# EAGLE design XR2 (EAGLE 7.4.0)
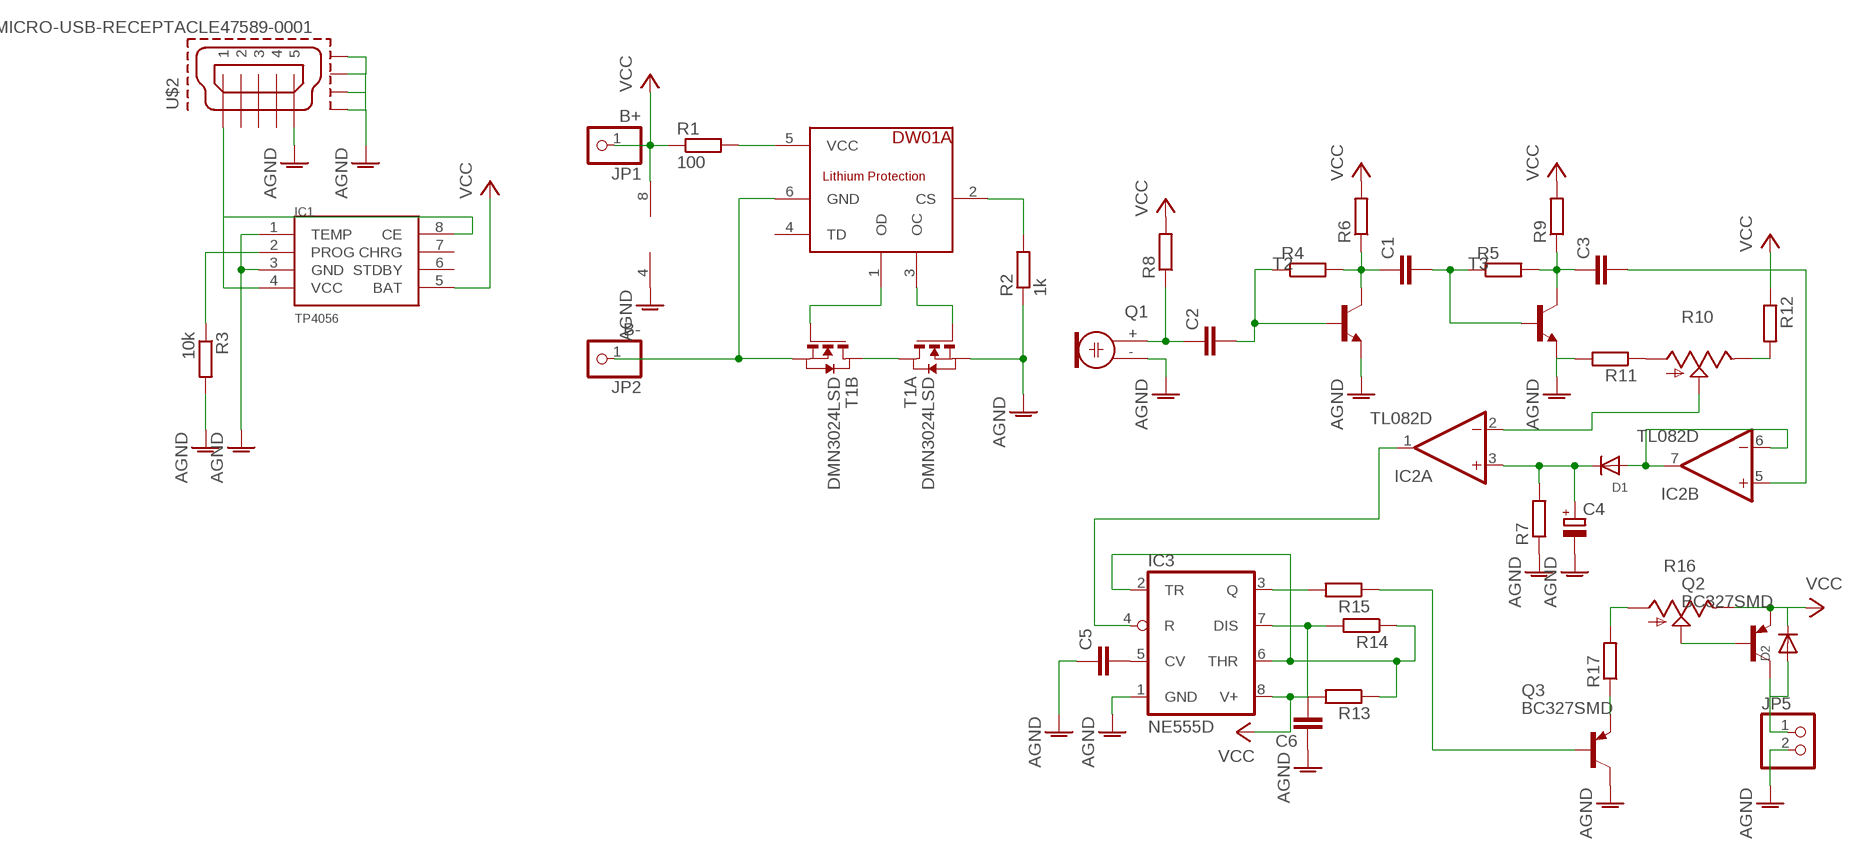
[diagram p0: schematic, sheet 1]

## Parts
C1  C-EUC0603  [C0603]
C2  C-EUC0603  [C0603]
C3  C-EUC0603  [C0603]
C4  CPOL-EU153CLV-0605  [153CLV-0605]
C5  C-EUC0603  [C0603]
C6  C-EUC0603  [C0603]
D1  DIODESOT23_REFLOW  [SOT23-R]
D2  DIODESOT23_REFLOW  [SOT23-R]
IC1  TP4056  [SOP-8]
IC2  TL082D  [SO08]
IC3  NE555D  [SO08]
JP1  B+  PINHD-1X1  [1X01]
JP2  B-  PINHD-1X1  [1X01]
JP5  PINHD-1X2  [1X02]
Q1  ELECTRET  [9.7ELECTRET]
Q2  BC327SMD  [SOT23-BEC]
Q3  BC327SMD  [SOT23-BEC]
R1  100  R-EU_R0805  [R0805]
R2  1k  R-EU_R0805  [R0805]
R3  10k  R-EU_R0805  [R0805]
R4  R-EU_R0603  [R0603]
R5  R-EU_R0603  [R0603]
R6  R-EU_R0603  [R0603]
R7  R-EU_R0603  [R0603]
R8  R-EU_R0603  [R0603]
R9  R-EU_R0603  [R0603]
R10  TRIM_US-B25U  [B25U]
R11  R-EU_R0603  [R0603]
R12  R-EU_R0603  [R0603]
R13  R-EU_R0603  [R0603]
R14  R-EU_R0603  [R0603]
R15  R-EU_R0603  [R0603]
R16  TRIM_US-B25U  [B25U]
R17  R-EU_R0603  [R0603]
T1  DMN3024LSD  [TSSOP-8]
T2  MMBT3904LT1-NPN-SOT23-BEC  [SOT23-BEC]
T3  MMBT3904LT1-NPN-SOT23-BEC  [SOT23-BEC]
U$1  DW01A  [SOT23-6]
U$2  MICRO-USB-RECEPTACLE47589-0001  [47589-0001]

## Nets
AGND: C4.- C5.1 C6.1 IC1.1(TEMP) IC1.3(GND) IC2.4(P:V-) IC3.1(GND) JP5.2 Q1.- Q3.C R2.1 R3.2 R7.1 R11.2 T1.2(A:S) T1.3(A:S) T2.E T3.E U$2.5 U$2.CASING1(GND1) U$2.CASING2(GND2) U$2.CASING3(GND3) U$2.CASING4(GND4)
N$1: T1.4(A:G) U$1.3(OC)
N$2: T1.5(B:G) U$1.1(OD)
N$3: T1.1(A:D) T1.8(B:D)
N$4: R2.2 U$1.2(CS)
N$5: JP2.1 T1.6(B:S) T1.7(B:S) U$1.6(GND)
N$6: R1.2 U$1.5(VCC)
N$7: IC1.2(PROG) R3.1
N$8: IC2.2(A:-IN) R10.S
N$9: IC1.4(VCC) IC1.8(CE) U$2.1
N$10: C2.1 Q1.+ R8.1
N$11: C2.2 R4.1 T2.B
N$12: C1.1 R4.2 R6.1 T2.C
N$13: C3.1 R5.2 R9.1 T3.C
N$14: C1.2 R5.1 T3.B
N$15: D1.1(A) IC2.6(B:-IN) IC2.7(B:OUT)
N$16: R10.A R11.1
N$17: C3.2 IC2.5(B:+IN)
N$18: C4.+ D1.3(C) IC2.3(A:+IN) R7.2
N$19: R10.E R12.2
N$20: IC2.1(A:OUT) IC3.4(R)
N$21: IC3.2(TR) IC3.6(THR) R13.1 R14.1
N$22: C5.2 IC3.5(CV)
N$23: IC3.3(Q) R15.2
N$24: Q3.B R15.1
N$25: C6.2 IC3.7(DIS) R14.2
N$26: Q3.E R17.1
N$27: R16.A R17.2
N$28: Q2.B R16.S
N$29: D2.1(A) JP5.1 Q2.C
VCC: D2.3(C) IC1.5(BAT) IC2.8(P:V+) IC3.8(V+) JP1.1 Q2.E R1.1 R6.2 R8.2 R9.2 R12.1 R13.2 R16.E
Unconnected: IC1.6(STDBY) IC1.7(CHRG) U$1.4(TD) U$2.2 U$2.3 U$2.4

## Library data of the parts
C1-C3 C5 C6 = rcl:C-EU: CAPACITOR, European symbol
C4 = rcl:CPOL-EU: POLARIZED CAPACITOR, European symbol
D1 D2 = adafruit:DIODE: Diode SMADIODE - SMA Surface Mount Package 20V 1A Schottky Diode Digikey: 641-1014-6-ND DO-1N4148 - Through Hole Small Current Diode SOD-123 20V 1 A (.5mV Vf) Schottky Diode - Digikey: MBRX120TPMSCT-ND SOD-323 10V 570mA (.38mV Vf, 3ns) Schottky Diode - Digikey: ZLLS410CT-ND SOD-523 30V 30mA Schottky Diode (RB751S-40TE61) - Digikey: RB751S-40TE61CT-ND SOT23-R/W - SOT23 Package (R = Solder Paste/Reflow Ovens, W = Hand-Soldering) BAT54Film 40V 300mA - Digikey: 497-7162-1-ND
IC1 = TP4056:TP4056
IC2 = linear:TL082: OP AMP Data sheet <http://www.ti.com/lit/ds/symlink/tl084a . pdf>; DATA_SHEET: <a href="http://www.ti.com/lit/ds/symlink/tl084a.pdf"> Data sheet </a>
IC3 = adafruit:*555: TIMER Changed DIP package to have round (not oval) pin pads http://www.ladyada.net/library/pcb/eaglelibrary.html
JP1 JP2 = pinhead:PINHD-1X1: PIN HEADER
JP5 = pinhead:PINHD-1X2: PIN HEADER
Q1 = adafruit:ELECTRET: Electret microphone Thru hole 2.54mm spacing with 9.7mm diameter
Q2 Q3 = transistor-pnp:BC327*: PNP Transistror
R1-R9 R11-R15 R17 = rcl:R-EU_: RESISTOR, European symbol
R10 R16 = pot:TRIM_US-: POTENTIOMETER
T1 = FS8205A:DMN3024LSD: DUAL N-CHANNEL ENHANCEMENT MODE MOSFET data sheet <http://goo.gl/dRgboR> Dave.Calaway Eagle Library <https://goo.gl/Muy1Tr>
T2 T3 = transistor-neu-to92:*-NPN-: NPN Transistror
U$1 = DW01a:DW01A
U$2 = con-molex-usb:MICRO-USB-RECEPTACLE: MICRO USB RECEPTACLES Micro-USB Receptacles, SMT, Lead-Free from MOLEX <http://www.molex.com/>. (C) 2014 Tomasz Boleslaw CEDRO, cederom@tlen.pl, http://www.tomek.cedro.info. Version 0.1 (2014-01-17): Initial release. Version 0.2 (2014-02-06): Updated 47589-0001 footprint pins/pads/milling. Following devices are included: 1. 47589-0001 Micro-USB AB Receptacle, Bottom Mount, SMT, Lead-Free <http://www.molex.com/molex/products/datasheet.jsp?part=active/0475890001_IO_CONNECTORS.xml> (Technical Drawing <http://www.molex.com/pdm_docs/sd/475890001_sd.pdf>).

## Board
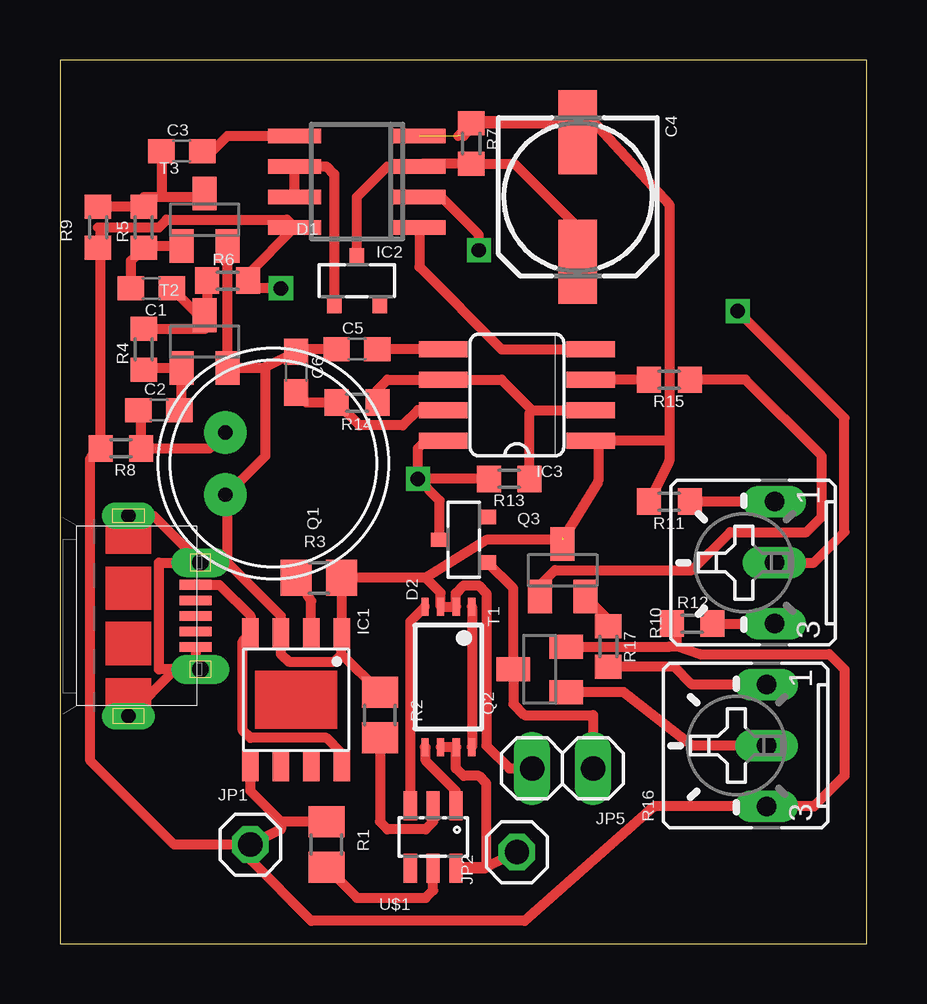
[diagram p1: board, top side]
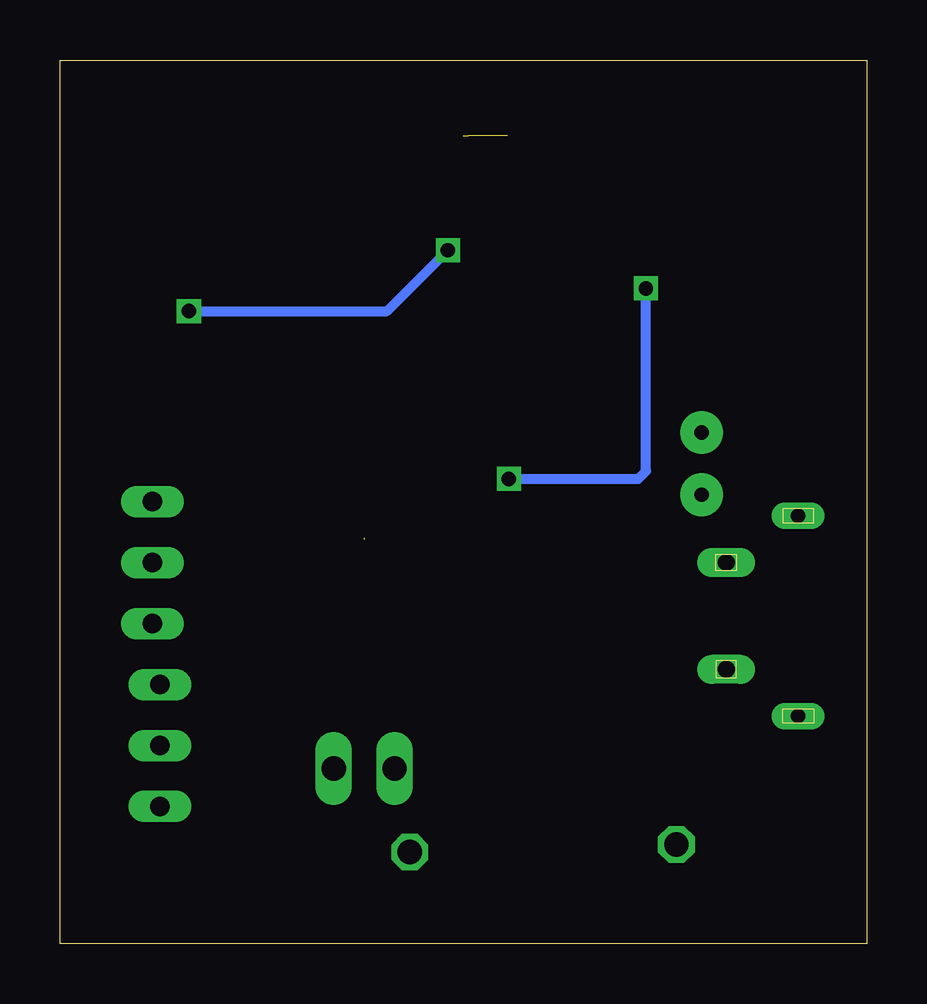
[diagram p2: board, bottom side, seen from below]

Size 33.63 x 36.82 mm. Coordinates in mm from the lower left corner, seen from the top.
Outline: 0,0 33.63,0 33.63,36.82 0,36.82 0,0
Copper layers (1*16): Top 0.035mm / dielectric 1.5mm / Bottom 0.035mm
Design rules "default": minimum track width 10mil, minimum drill 24mil, track to track 8mil, track to pad 8mil, pad to pad 8mil, via to via 8mil, smd to smd 8mil, copper to edge 40mil, drill to drill 8mil, minimum pad ring 10mil, minimum via ring 8mil, stop-mask expansion 4mil, vias tented up to drill 0mil, thermal gap 10mil

### Footprints (pad centres in the part's own frame; a part is rotated, then mirrored left to right if it is on the bottom)
C0603 = smd 1.1 x 1: 1 -0.85,0; 2 0.85,0
153CLV-0605 = smd 3.5 x 1.6: + 2.7,0; - -2.7,0
SOT23-R = smd 0.6 x 0.7: 1 -0.95,-1; 2 0.95,-1; 3 0,1
SOP-8 = smd 1.3 x 0.7: 1 -2.75,1.905; 2 -2.75,0.635; 3 -2.75,-0.635; 4 -2.75,-1.905; 5 2.75,-1.905; 6 2.75,-0.635; 7 2.75,0.635; 8 2.75,1.905
SO08 = smd 0.6 x 2.2: 1 -1.905,-2.6; 2 -0.635,-2.6; 3 0.635,-2.6; 4 1.905,-2.6; 5 1.905,2.6; 6 0.635,2.6; 7 -0.635,2.6; 8 -1.905,2.6
SO08' = smd 0.66 x 2.032: 1 -1.905,-3.073; 2 -0.635,-3.073; 3 0.635,-3.073; 4 1.905,-3.073; 5 1.905,3.073; 6 0.635,3.073; 7 -0.635,3.073; 8 -1.905,3.073
1X01 = drill 1.016 octagon: 1 0,0
1X02 = drill 1.016 long: 1 -1.27,0; 2 1.27,0
9.7ELECTRET = drill 0.6 pad 1.778: + 1.3,2; - -1.3,2
SOT23-BEC = smd 1 x 1.4: B -0.95,-1.1; C 0,1.1; E 0.95,-1.1
R0805 = smd 1.3 x 1.5: 1 -0.95,0; 2 0.95,0
R0603 = smd 1 x 1.1: 1 -0.85,0; 2 0.85,0
B25U = drill 0.813 long: A 2.54,-0.889; E -2.54,-0.889; S 0,-0.889
TSSOP-8 = smd 0.3 x 0.75: 1 -0.975,-2.925; 2 -0.325,-2.925; 3 0.325,-2.925; 4 0.975,-2.925; 5 0.975,2.925; 6 0.325,2.925; 7 -0.325,2.925; 8 -0.975,2.925
SOT23-6 = smd 0.55 x 1.2: 1 -0.95,-1.3; 2 0,-1.3; 3 0.95,-1.3; 4 0.95,1.3; 5 0,1.3; 6 -0.95,1.3
47589-0001 = smd 1.35 x 0.4: 1 2.8,1.3; 2 2.8,0.65; 3 2.8,0; 4 2.8,-0.65; 5 2.8,-1.3 | drill 0.6 pad 0.95 long: CASING1 0,4.175; CASING2 0,-4.175 | drill 0.7 pad 1.1 long: CASING3 3,2.225; CASING4 3,-2.225

### Placement (x,y rotation side)
C1  3.81,27.3 180 top
C2  4.13,22.23 0 top
C3  5.08,33.02 0 top
C4  21.59,31.11 270 top
C5  12.38,24.77 0 top
C6  9.84,23.81 270 top
D1  12.38,27.62 0 top
D2  16.83,16.83 90 top
IC1  9.84,10.16 270 top
IC2  12.38,31.75 90 top
IC3  NE555D  [SO08']  19.05,22.86 90 top
JP1  7.94,4.13 0 top
JP2  19.05,3.81 90 top
JP5  20.95,7.3 180 top
Q1  8.89,20 90 top
Q2  20,11.43 90 top
Q3  20.95,15.56 0 top
R1  11.11,4.13 270 top
R2  13.34,9.53 270 top
R3  10.79,15.24 0 top
R4  3.49,24.77 90 top
R5  3.49,29.84 90 top
R6  6.99,27.62 0 top
R7  17.14,33.34 270 top
R8  2.54,20.64 180 top
R9  1.59,29.84 270 top
R10  28.89,15.88 90 top
R11  25.4,18.41 180 top
R12  26.35,13.34 0 top
R13  18.73,19.37 180 top
R14  12.38,22.54 180 top
R15  25.4,23.5 180 top
R16  28.57,8.26 90 top
R17  22.86,12.38 270 top
T1  16.19,11.11 180 top
T2  6.03,25.08 0 top
T3  6.03,30.16 0 top
U$1  15.56,4.45 180 top
U$2  2.86,13.65 0 top

### Tracks (layer width: path | path; a pad name or v marks a point on that pad's centre or on a via)
AGND  (3 unrouted)
  Top 0.406: T3.E T2.E 8.57,23.98 | C5.1 9.95,24.77 C6.1 8.57,24.03 8.57,23.98 | 11.75,12.06 11.43,11.75 9.53,11.75 9.21,12.06 IC1.3 9.21,13.65 6.98,15.88 | 11.75,12.06 IC1.1 11.74,14.18 R3.2 15.24,15.24 | 15.24,15.24 15.87,14.61 T1.3 T1.2 16.52,14.6 16.51,14.61 16.83,14.92 17.46,14.92 17.78,14.61 17.78,8.26 18.73,7.3 JP5.2 | R2.1 11.75,12.06 | 6.98,15.88 U$2.CASING3 5.47,16.27 | 6.98,15.88 6.98,18.61 Q1.- 6.96,18.7 8.57,20.32 8.57,23.98 | 16.61,33.66 R7.1 21.33,34.19 C4.- | U$2.CASING1 3.91,17.83 5.47,16.27 | U$2.5 5.66,11.63 U$2.CASING4 | U$2.CASING4 4.81,11.43 U$2.CASING2 | U$2.CASING4 4.76,11.43 4.13,11.43 4.13,15.88 5.08,15.88 5.47,16.27 | 16.83,33.66 17.46,34.29 22.23,34.29 25.4,30.8 25.4,20.95 | 25.4,20.95 22.44,20.95 | 22.44,20.95 IC3.1 | 22.44,20.95 22.44,19.27 20.95,16.83 17.78,16.83 15.24,15.24 | Q3.C 20.95,16.92 21.1,17.06 | 25.4,20.95 25.4,20.11 R11.2
N$1
  Top 0.406: U$1.3 14.61,13.43 T1.4
N$2
  Top 0.406: U$1.1 16.51,6.35 15.24,7.62 15.24,8.16 T1.5
N$3
  Top 0.406: T1.1 T1.8
N$4
  Top 0.406: U$1.2 15.56,5.08 15.24,4.76 13.65,4.76 13.34,5.08 R2.2
N$5
  Top 0.406: JP2.1 17.78,3.17 | 17.78,3.17 16.54,3.17 U$1.6 17.75,3.15 17.78,3.17 | 17.78,3.17 17.78,6.67 17.46,6.99 16.83,6.99 16.51,7.3 T1.7 T1.6
N$6
  Top 0.406: R1.2 12.38,1.91 15.24,1.91 15.56,2.22 U$1.5
N$7
  Top 0.406: IC1.2 10.48,14.29 R3.1
N$8  (via drill 0.6)
  Top 0.406: R10.S 31.43,15.88 32.7,17.14 32.7,21.91 v28.26,26.35 | v17.46,28.89 17.46,29.53 15.88,31.11 IC2.2
  Bottom 0.406: v28.26,26.35 20,26.35 v17.46,28.89
N$9
  Top 0.406: IC1.8 11.75,7.94 11.11,8.57 7.94,8.57 7.62,8.89 7.62,12.59 IC1.4 7.94,13.65 6.64,14.95 U$2.1
N$10
  Top 0.406: C2.1 3.39,22.11 R8.1 6.22,20.64 Q1.+
N$11
  Top 0.406: R4.1 3.49,23.98 T2.B 5.08,22.23 C2.2
N$12
  Top 0.406: R4.2 6.03,25.61 T2.C | T2.C 5.78,26.18 C1.1 | R6.1 6.13,26.29 T2.C
N$13
  Top 0.406: R9.1 R5.2 3.49,31.11 4.13,31.11 | 4.13,31.11 6.03,31.11 T3.C | C3.1 4.23,31.22 4.13,31.11
N$14
  Top 0.406: T3.B 3.49,29.06 R5.1 2.96,28.46 C1.2
N$15
  Top 0.406: IC2.7 IC2.6 11.11,32.38 11.43,32.07 D1.1
N$16
  Top 0.406: R10.A R11.1
N$17
  Top 0.406: C3.2 6.35,33.02 6.99,33.66 IC2.5
N$18
  Top 0.406: D1.3 12.38,31.11 13.65,32.38 IC2.3 15.09,32.49 R7.2 18.95,32.49 21.59,29.84 C4.+
N$19
  Top 0.406: R12.2 R10.E
N$20
  Top 0.406: IC2.1 14.98,28.2 18.41,24.77 IC3.4
N$21
  Top 0.406: 19.68,22.23 18.41,23.5 IC3.6 13.65,23.5 13.23,23.07 R14.1 | 19.68,22.23 IC3.2 | R13.1 19.58,22.12 19.68,22.23
N$22
  Top 0.406: IC3.5 C5.2
N$23
  Top 0.406: R15.2 IC3.3
N$24
  Top 0.406: Q3.B 20,14.93 20.64,15.56 26.35,15.56 27.94,17.14 31.11,17.14 31.75,17.78 31.75,20.32 28.57,23.5 R15.1
N$25
  Top 0.406: IC3.7 14.92,22.23 14.29,21.59 12.48,21.59 R14.2 10.26,22.54 C6.2
N$26
  Top 0.406: R17.1 23.13,13.23 Q3.E
N$27
  Top 0.406: R16.A 26.35,10.79 25.61,11.53 R17.2
N$28
  Top 0.406: R16.S 26.35,8.26 23.5,10.48 Q2.B
N$29
  Top 0.406: D2.1 18.9,14.8 Q2.C 18.9,9.99 19.37,9.53 22.23,9.53 JP5.1
VCC  (via drill 0.6)
  Top 0.406: 1.69,28.89 R8.2 1.27,20.22 1.27,7.62 4.76,4.13 JP1.1 | 1.69,28.89 R9.2 | 1.69,28.89 1.69,29.74 1.59,29.84 4.13,29.84 4.45,30.16 9.46,30.16 IC2.8 7.83,27.9 R6.2 8.15,27.3 v9.21,27.3 | R1.1 9.21,5.08 | 9.21,5.08 7.94,6.35 IC1.5 | 9.21,5.08 9.21,4.76 JP1.1 | R13.2 v14.92,19.37 | 25.72,12.38 25.72,12.91 R12.1 | Q2.E 25.4,12.38 25.72,12.38 | 25.72,12.38 26.67,12.06 32.07,12.06 32.7,11.43 32.7,6.99 31.43,5.71 R16.E 24.77,5.71 19.37,0.95 10.48,0.95 7.94,3.49 JP1.1 | D2.3 15.83,18.46 v14.92,19.37 | v14.92,19.37 14.92,20.64 15.24,20.95 IC3.8
  Bottom 0.406: v14.92,19.37 9.53,19.37 9.21,19.68 v9.21,27.3